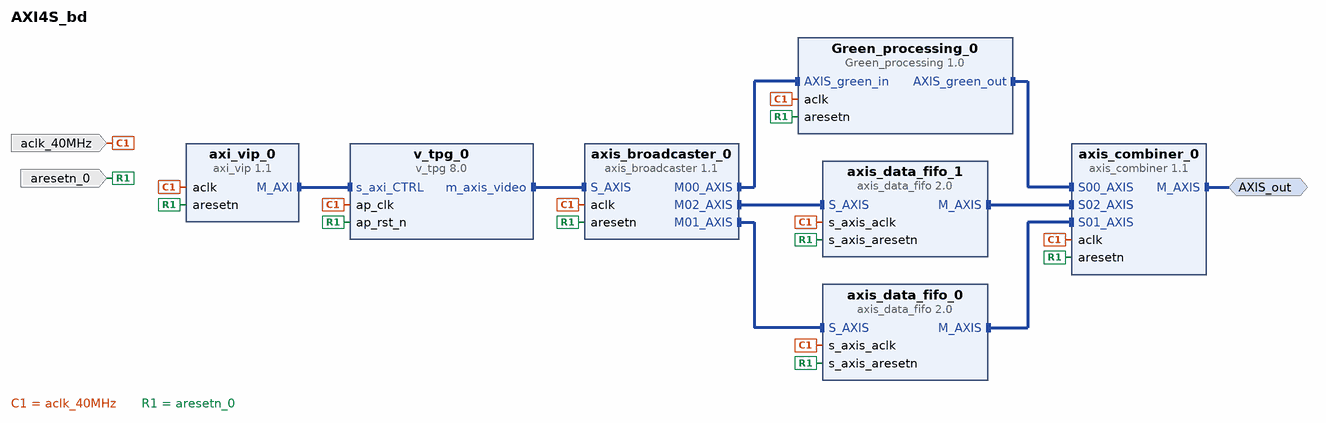
[diagram p0: block diagram of the top level]
# Vivado block design AXI4S_bd, xc7z020clg484-1, Vivado 2019.1
create_bd_design AXI4S_bd

create_bd_intf_port -mode Master -vlnv xilinx.com:interface:axis_rtl:1.0 AXIS_out
set_property -dict {CONFIG.FREQ_HZ 40000000} [get_bd_intf_ports AXIS_out]
create_bd_port -dir I -type clk aclk_40MHz
set_property -dict [list \
  CONFIG.ASSOCIATED_BUSIF AXIS_out \
  CONFIG.ASSOCIATED_RESET aresetn_0 \
  CONFIG.FREQ_HZ 40000000 \
] [get_bd_ports aclk_40MHz]
create_bd_port -dir I -type rst aresetn_0

create_bd_cell -type ip -vlnv xilinx.com:ip:axi_vip:1.1 axi_vip_0
set_property -dict [list \
  CONFIG.ADDR_WIDTH 12 \
  CONFIG.DATA_WIDTH 32 \
  CONFIG.HAS_BRESP 1 \
  CONFIG.HAS_PROT 1 \
  CONFIG.HAS_RRESP 1 \
  CONFIG.HAS_WSTRB 1 \
  CONFIG.INTERFACE_MODE MASTER \
  CONFIG.PROTOCOL AXI4LITE \
  CONFIG.READ_WRITE_MODE READ_WRITE \
] [get_bd_cells axi_vip_0]
create_bd_cell -type ip -vlnv xilinx.com:ip:v_tpg:8.0 v_tpg_0
create_bd_cell -type ip -vlnv xilinx.com:ip:axis_broadcaster:1.1 axis_broadcaster_0
set_property -dict [list \
  CONFIG.M00_TDATA_REMAP {tdata[7:0]} \
  CONFIG.M01_TDATA_REMAP {tdata[15:8]} \
  CONFIG.M02_TDATA_REMAP {tdata[23:16]} \
  CONFIG.M_TDATA_NUM_BYTES 1 \
  CONFIG.NUM_MI 3 \
  CONFIG.S_TDATA_NUM_BYTES 3 \
] [get_bd_cells axis_broadcaster_0]
create_bd_cell -type ip -vlnv xilinx.com:ip:axis_combiner:1.1 axis_combiner_0
set_property -dict {CONFIG.NUM_SI 3} [get_bd_cells axis_combiner_0]
create_bd_cell -type ip -vlnv xilinx.com:XVES:Green_processing:1.0 Green_processing_0
create_bd_cell -type ip -vlnv xilinx.com:ip:axis_data_fifo:2.0 axis_data_fifo_0
create_bd_cell -type ip -vlnv xilinx.com:ip:axis_data_fifo:2.0 axis_data_fifo_1

# ---- connections ----

connect_bd_intf_net [get_bd_intf_pins Green_processing_0/AXIS_green_out] [get_bd_intf_pins axis_combiner_0/S00_AXIS]
connect_bd_intf_net [get_bd_intf_pins axis_broadcaster_0/M00_AXIS] [get_bd_intf_pins Green_processing_0/AXIS_green_in]
connect_bd_intf_net [get_bd_intf_pins axis_data_fifo_1/M_AXIS] [get_bd_intf_pins axis_combiner_0/S02_AXIS]
connect_bd_intf_net [get_bd_intf_pins v_tpg_0/m_axis_video] [get_bd_intf_pins axis_broadcaster_0/S_AXIS]
connect_bd_intf_net [get_bd_intf_ports AXIS_out] [get_bd_intf_pins axis_combiner_0/M_AXIS]
connect_bd_intf_net [get_bd_intf_pins axis_broadcaster_0/M01_AXIS] [get_bd_intf_pins axis_data_fifo_0/S_AXIS]
connect_bd_intf_net [get_bd_intf_pins axis_broadcaster_0/M02_AXIS] [get_bd_intf_pins axis_data_fifo_1/S_AXIS]
connect_bd_intf_net [get_bd_intf_pins axi_vip_0/M_AXI] [get_bd_intf_pins v_tpg_0/s_axi_CTRL]
connect_bd_intf_net [get_bd_intf_pins axis_data_fifo_0/M_AXIS] [get_bd_intf_pins axis_combiner_0/S01_AXIS]
connect_bd_net -net aclk_0_1 [get_bd_ports aclk_40MHz] \
  [get_bd_pins axi_vip_0/aclk] [get_bd_pins v_tpg_0/ap_clk] [get_bd_pins axis_broadcaster_0/aclk] \
  [get_bd_pins axis_combiner_0/aclk] [get_bd_pins Green_processing_0/aclk] [get_bd_pins axis_data_fifo_0/s_axis_aclk] \
  [get_bd_pins axis_data_fifo_1/s_axis_aclk]
connect_bd_net -net aresetn_0_1 [get_bd_ports aresetn_0] \
  [get_bd_pins axi_vip_0/aresetn] [get_bd_pins v_tpg_0/ap_rst_n] [get_bd_pins axis_broadcaster_0/aresetn] \
  [get_bd_pins axis_combiner_0/aresetn] [get_bd_pins Green_processing_0/aresetn] \
  [get_bd_pins axis_data_fifo_1/s_axis_aresetn] [get_bd_pins axis_data_fifo_0/s_axis_aresetn]

# ---- address map ----
assign_bd_address -offset 0x000 -range 4K -target_address_space [get_bd_addr_spaces axi_vip_0/Master_AXI] [get_bd_addr_segs v_tpg_0/s_axi_CTRL/Reg]

validate_bd_design
save_bd_design
